# Altium project 4G_V1.3.PrjPcb
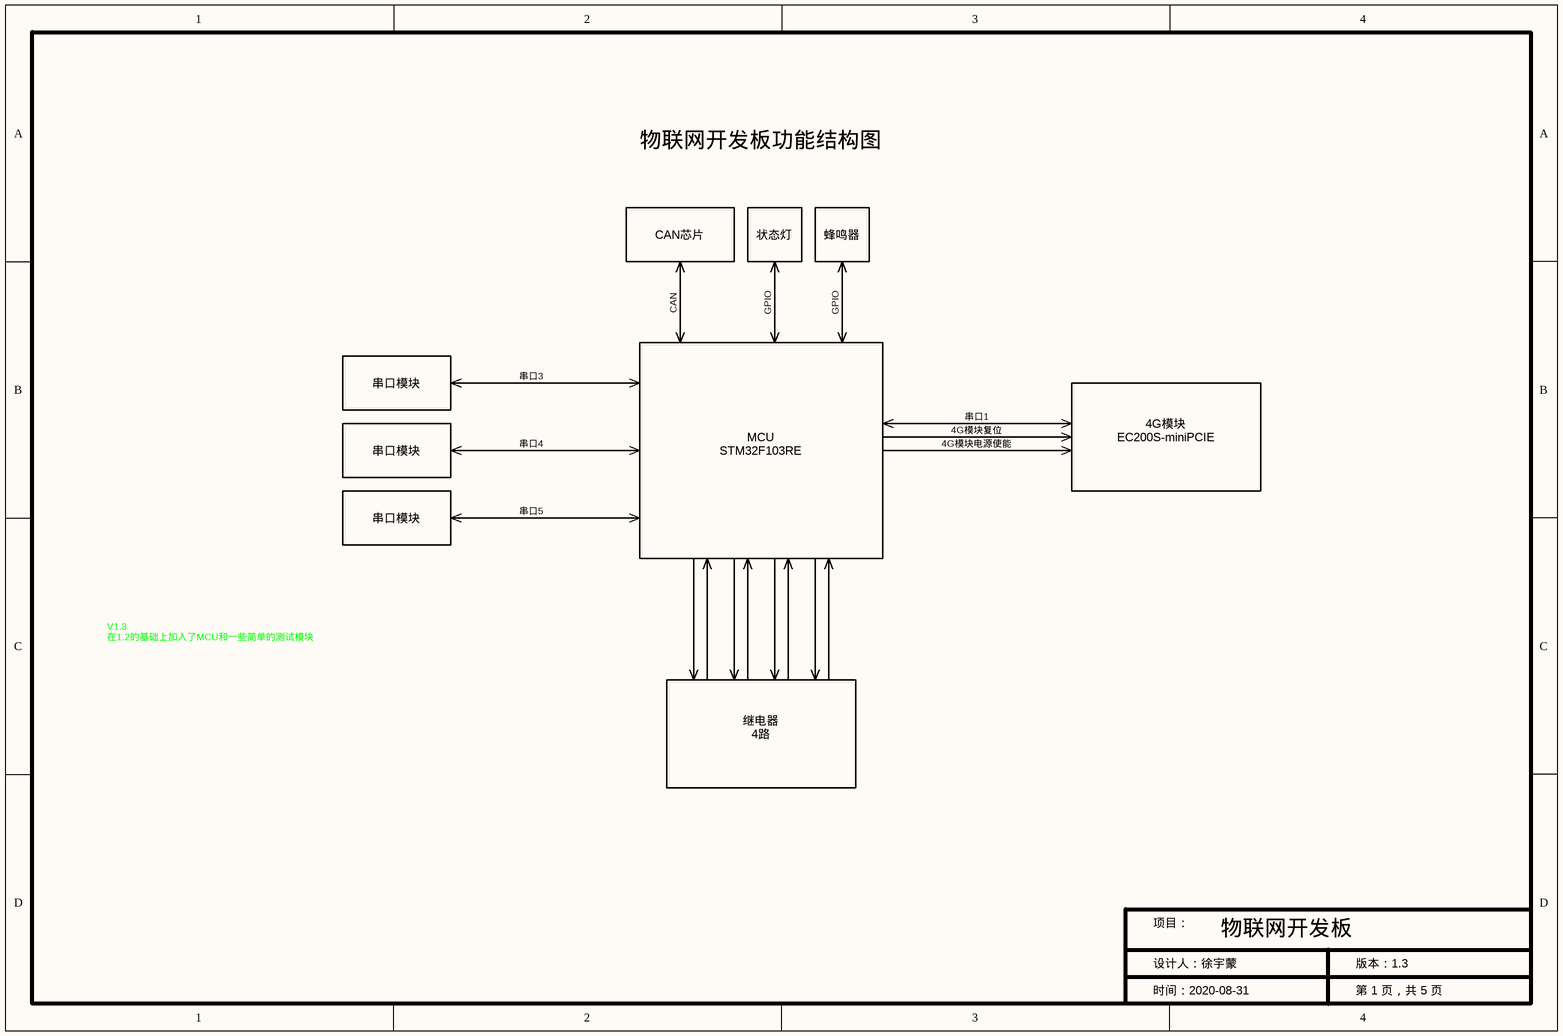
[diagram p0: 01_模块结构图.SchDoc]
5 sheets, 88 parts. Net scope: global (net labels, ports and power ports of the same name join across sheets).
Board file: 物联网开发板.PcbDoc
Sheets:
  01_模块结构图.SchDoc
  02_电源部分.SchDoc
  03_MCU部分.SchDoc
  04_4G模块和外围电路.SchDoc
  05_信号驱动部分.SchDoc

## Sheet 01_模块结构图.SchDoc
size A4; DocumentNumber: 1; SheetNumber: 1; SheetTotal: 4

### Notes on the sheet
- 物联网开发板功能结构图
- CAN芯片
- 状态灯
- 蜂鸣器
- CAN
- GPIO
- 串口模块
- 串口3
- 串口4
- MCU
- STM32F103RE
- 串口1
- 4G模块复位
- 4G模块电源使能
- 4G模块
- EC200S-miniPCIE
- 串口5
- V1.3
  在1.2的基础上加入了MCU和一些简单的测试模块
- 继电器
- 4路
- 项目：
- 物联网开发板
- 时间：2020-08-31
- 设计人：徐宇蒙
- 第 1 页，共 5 页
- 版本：1.3

## Sheet 02_电源部分.SchDoc
size A4; DocumentNumber: 2; SheetNumber: 2; SheetTotal: 4
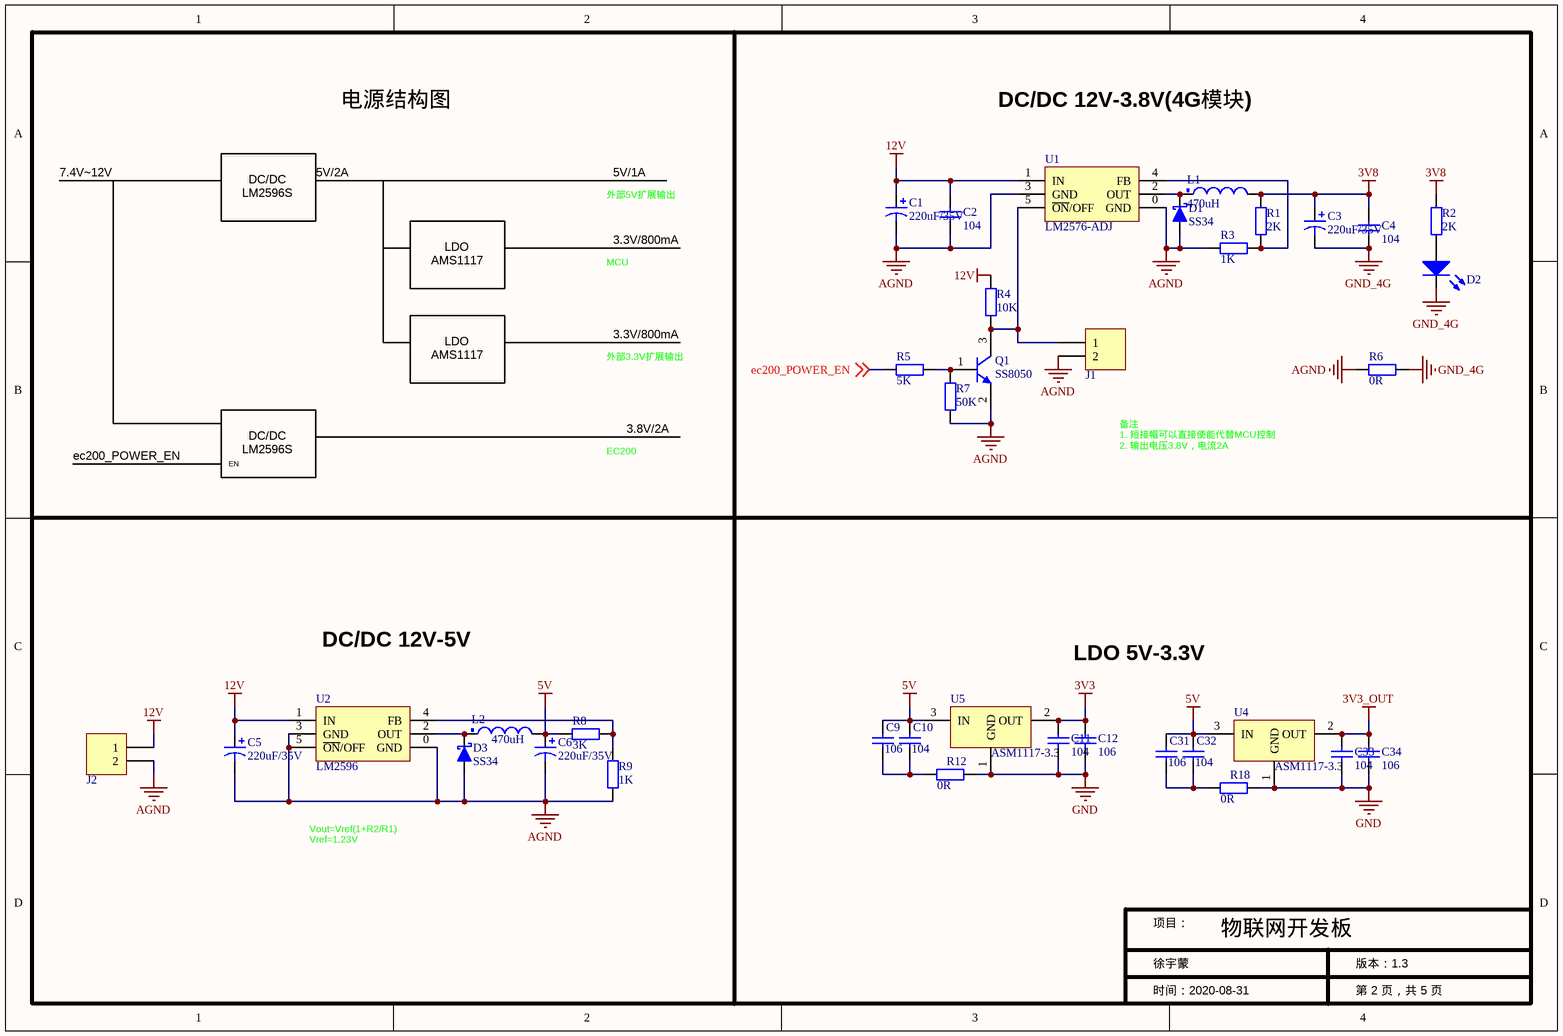
[diagram p1: 02_电源部分.SchDoc]

### Parts
C1  value 220uF/35V  [Cap8x10.5mm]  (hidden comment: Cap Pol)
C2  value 104  [CAP-0603]  (hidden comment: Cap)
C3  value 220uF/35V  [Cap8x10.5mm]  (hidden comment: Cap Pol)
C4  value 104  [CAP-0603]  (hidden comment: Cap)
C5  value 220uF/35V  [Cap8x10.5mm]  (hidden comment: Cap Pol)
C6  value 220uF/35V  [Cap8x10.5mm]  (hidden comment: Cap Pol)
C9  value 106  [CAP-0603]  (hidden comment: Cap)
C10  value 104  [CAP-0603]  (hidden comment: Cap)
C11  value 104  [CAP-0603]  (hidden comment: Cap)
C12  value 106  [CAP-0603]  (hidden comment: Cap)
C31  value 106  [CAP-0603]  (hidden comment: Cap)
C32  value 104  [CAP-0603]  (hidden comment: Cap)
C33  value 104  [CAP-0603]  (hidden comment: Cap)
C34  value 106  [CAP-0603]  (hidden comment: Cap)
D1  SS34  [SMA(DO-214AC)]
D2  LED  [LED_0805]  (value not drawn)
D3  SS34  [SMA(DO-214AC)]
J1  Header 2  [Header_2X1_2.54]  (value not drawn)
J2  Header 2  [Header_HT_2P_5.08_Right]  (value not drawn)
L1  value 470uH  [CD43]  (hidden comment: Inductor)
L2  value 470uH  [CD43]  (hidden comment: Inductor)
Q1  SS8050  [SOT-23]
R1  value 2K  [0603]  (hidden comment: Res)
R2  value 2K  [0603]  (hidden comment: Res)
R3  value 1K  [0603]  (hidden comment: Res)
R4  value 10K  [0603]  (hidden comment: Res)
R5  value 5K  [0603]  (hidden comment: Res)
R6  value 0R  [0805]  (hidden comment: Res)
R7  value 50K  [0603]  (hidden comment: Res)
R8  value 3K  [0603]  (hidden comment: Res)
R9  value 1K  [0603]  (hidden comment: Res)
R12  value 0R  [0805]  (hidden comment: Res)
R18  value 0R  [0805]  (hidden comment: Res)
U1  LM2576-ADJ  [TO-263-5 无背面散热]
U2  LM2596  [TO-263-5 无背面散热]
U4  ASM1117-3.3  [SOT-223]
U5  ASM1117-3.3  [SOT-223]

### Nets
3V3: C11.2 C12.2 U5.2(OUT)
3V3_OUT: C33.2 C34.2 U4.2(OUT)
3V8: C3.1 C4.2 L1.2 R1.1 R2.2
5V: C6.1 C9.2 C10.2 C31.2 C32.2 L2.2 R8.1 U4.3(IN) U5.3(IN)
12V: C1.1 C2.2 C5.1 J2.1 R4.1 U1.1(IN) U2.1(IN)
AGND: C1.2 C2.1 C5.2 C6.2 D1.1(A) D3.1(A) J1.2 J2.2 Q1.2(E) R3.1 R6.1 R7.2 R9.1 U1.0(GND) U1.3(GND) U2.0(GND) U2.3(GND) U2.5(~{ON}/OFF)
GND: C11.1 C12.1 C33.1 C34.1 R12.2 R18.2 U4.1(GND) U5.1(GND)
GND_4G: C3.2 C4.1 D2.2(K) R6.2
ec200_POWER_EN: R5.1 ; off-sheet ec200_POWER_EN  [project net PA1]
NetC9_1: C9.1 C10.1 R12.1
NetC31_1: C31.1 C32.1 R18.1
NetD1_2: D1.2(K) L1.1 U1.2(OUT)
NetD2_1: D2.1(A) R2.1
NetD3_2: D3.2(K) L2.1 U2.2(OUT)
NetJ1_1: J1.1 Q1.3(C) R4.2 U1.5(~{ON}/OFF)
NetQ1_1: Q1.1(B) R5.2 R7.1
NetR1_2: R1.2 R3.2 U1.4(FB)
NetR8_2: R8.2 R9.2 U2.4(FB)

### Notes on the sheet
- 电源结构图
- DC/DC 12V-3.8V(4G模块)
- 7.4V~12V
- 5V/2A
- 5V/1A
- LM2596S
- DC/DC
- LDO
- 外部5V扩展输出
- 3.3V/800mA
- AMS1117
- MCU
- 外部3.3V扩展输出
- 3.8V/2A
- ec200_POWER_EN
- EN
- EC200
- 备注
  1. 短接帽可以直接使能代替MCU控制
  2. 输出电压3.8V，电流2A
- DC/DC 12V-5V
- LDO 5V-3.3V
- Vout=Vref(1+R2/R1)
  Vref=1.23V
- 项目：
- 物联网开发板
- 徐宇蒙
- 时间：2020-08-31
- 第 2 页，共 5 页
- 版本：1.3

### Library data of the parts
C1 C3 C5 C6 = Cap Pol: 贴片电解电容 8*10.5mm; Published: 8-Jun-2000; LatestRevisionDate: 17-Jul-2002; LatestRevisionNote: Re-released for DXP Platform.; PackageReference: POLAR0.8; Publisher: Altium Limited
C2 C4 C9-C12 C31-C34 = Cap: 无极性电容; Published: 8-Jun-2000; LatestRevisionDate: 17-Jul-2002; LatestRevisionNote: Re-released for DXP Platform.; PackageReference: RAD-0.3; Publisher: Altium Limited
D1 D3 = D Schottky: Schottky Diode; Published: 8-Jun-2000; LatestRevisionDate: 17-Jul-2002; LatestRevisionNote: Re-released for DXP Platform.; PackageReference: SMB; Publisher: Altium Limited; Code_JEDEC: DO-214-AA
D2 = LED: 发光二极管; Published: 8-Jun-2000; LatestRevisionDate: 08-Jul-2005; LatestRevisionNote: Mech Layer 1 removed.; PackageReference: LED-0; Publisher: Altium Limited
J1 J2 = Header 2: 接插件; LatestRevisionDate: 17-Jul-2002; LatestRevisionNote: Re-released for DXP Platform.; Publisher: Altium Limited
L1 L2 = Inductor: 贴片功率电感; Code_IEC: 1005; Published: 8-Jun-2000; LatestRevisionDate: 17-Jul-2002; LatestRevisionNote: Re-released for DXP Platform.; PackageReference: 0402-A; Publisher: Altium Limited; Code_JEITA: 0402
Q1 = SS8050: NPN贴片三极管; Published: 8-Jun-2000; LatestRevisionDate: 15-Jan-2003; LatestRevisionNote: PCB Footprint 'BCY-W3/D4.7' replaced; DatasheetDocument: 1997; PackageDocument: Sep-1998; PackageReference: TO-92A; Publisher: Altium Limited; Code_JEDEC: TO-92A; ComponentLink1Description: Manufacturer Link; ComponentLink1URL: http://www.fairchildsemi.com/; ComponentLink2Description: Datasheet; ComponentLink2URL: http://www.fairchildsemi.com/ds/2N%2F2N3904.pdf
R1-R9 R12 R18 = Res: 贴片电阻; Published: 8-Jun-2000; LatestRevisionDate: 17-Jul-2002; LatestRevisionNote: Re-released for DXP Platform.; PackageReference: AXIAL-0.4; Publisher: Altium Limited
U1 = LM2576
U2 = LM2596: DC/DC
U4 U5 = ASM1117: 3.3V稳压芯片

## Sheet 03_MCU部分.SchDoc
size A4; DocumentNumber: 3; SheetNumber: 3; SheetTotal: 4
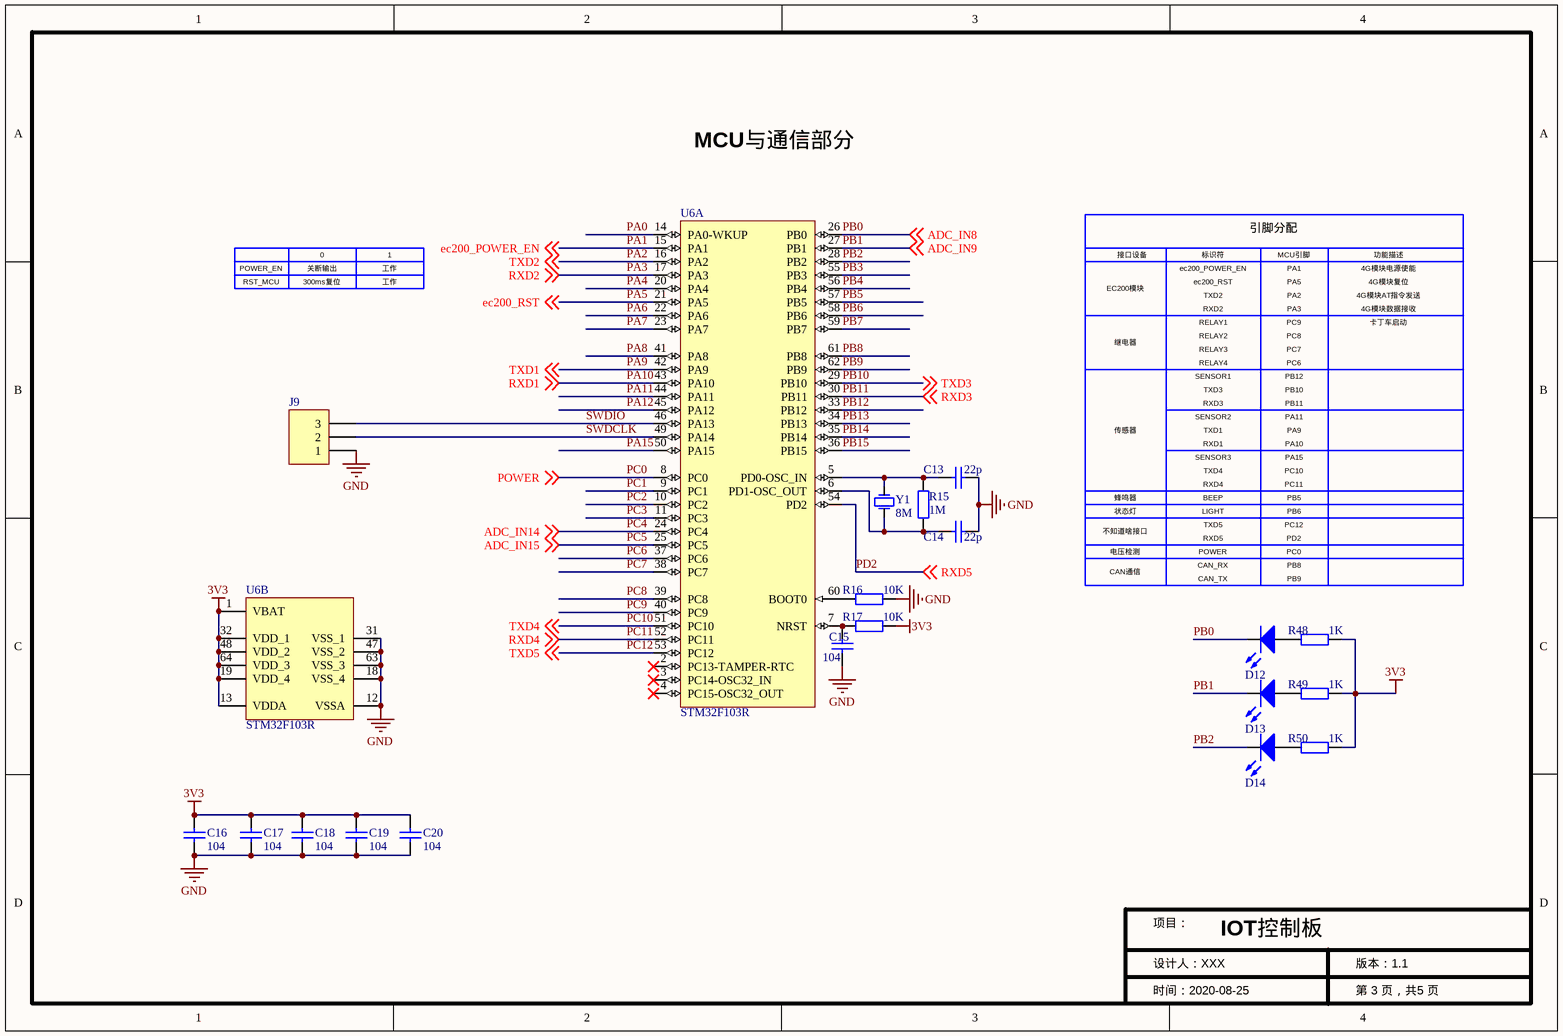
[diagram p2: 03_MCU部分.SchDoc]

### Parts
C13  value 22p  [CAP-0603]  (hidden comment: Cap)
C14  value 22p  [CAP-0603]  (hidden comment: Cap)
C15  value 104  [CAP-0603]  (hidden comment: Cap)
C16  value 104  [CAP-0603]  (hidden comment: Cap)
C17  value 104  [CAP-0603]  (hidden comment: Cap)
C18  value 104  [CAP-0603]  (hidden comment: Cap)
C19  value 104  [CAP-0603]  (hidden comment: Cap)
C20  value 104  [CAP-0603]  (hidden comment: Cap)
D12  LED  [LED_0805]  (value not drawn)
D13  LED  [LED_0805]  (value not drawn)
D14  LED  [LED_0805]  (value not drawn)
J9  Header3  [Header_3X1_2.54_排针]  (value not drawn)
R15  value 1M  [0603]  (hidden comment: Res)
R16  value 10K  [0603]  (hidden comment: Res)
R17  value 10K  [0603]  (hidden comment: Res)
R48  value 1K  [0603]  (hidden comment: Res)
R49  value 1K  [0603]  (hidden comment: Res)
R50  value 1K  [0603]  (hidden comment: Res)
U6  STM32F103R  [LQFP64]  (parts A,B of 2)
Y1  value 8M  [X-SM49]  (hidden comment: XTAL)

### Nets
3V3: C16.2 C17.2 C18.2 C19.2 C20.2 R17.1 R48.1 R49.1 R50.1 U6.1(VBAT) U6.13(VDDA) U6.19(VDD_4) U6.32(VDD_1) U6.48(VDD_2) U6.64(VDD_3)
GND: C13.1 C14.1 C15.1 C16.1 C17.1 C18.1 C19.1 C20.1 J9.1 R16.1 U6.12(VSSA) U6.18(VSS_4) U6.31(VSS_1) U6.47(VSS_2) U6.63(VSS_3)
PA0: U6.14(PA0-WKUP)
PA1: U6.15(PA1) ; off-sheet ec200_POWER_EN  [also labelled ec200_POWER_EN]
PA2: U6.16(PA2) ; off-sheet TXD2  [also labelled TXD2]
PA3: U6.17(PA3) ; off-sheet RXD2  [also labelled RXD2]
PA4: U6.20(PA4)
PA5: U6.21(PA5) ; off-sheet ec200_RST  [also labelled ec200_RST]
PA6: U6.22(PA6)
PA7: U6.23(PA7)
PA8: U6.41(PA8)
PA9: U6.42(PA9) ; off-sheet TXD1  [also labelled TXD1]
PA10: U6.43(PA10) ; off-sheet RXD1  [also labelled RXD1]
PA11: U6.44(PA11)
PA12: U6.45(PA12)
PA15: U6.50(PA15)
PB0: D12.2(K) U6.26(PB0) ; off-sheet ADC_IN8  [also labelled ADC_IN8]
PB1: D13.2(K) U6.27(PB1) ; off-sheet ADC_IN9  [also labelled ADC_IN9]
PB2: D14.2(K) U6.28(PB2)
PB3: U6.55(PB3)
PB4: U6.56(PB4)
PB5: U6.57(PB5)
PB6: U6.58(PB6)
PB7: U6.59(PB7)
PB8: U6.61(PB8)
PB9: U6.62(PB9)
PB10: U6.29(PB10) ; off-sheet TXD3  [also labelled TXD3]
PB11: U6.30(PB11) ; off-sheet RXD3  [also labelled RXD3]
PB12: U6.33(PB12)
PB13: U6.34(PB13)
PB14: U6.35(PB14)
PB15: U6.36(PB15)
PC0: U6.8(PC0) ; off-sheet POWER  [also labelled POWER]
PC1: U6.9(PC1)
PC2: U6.10(PC2)
PC3: U6.11(PC3)
PC4: U6.24(PC4) ; off-sheet ADC_IN14  [also labelled ADC_IN14]
PC5: U6.25(PC5) ; off-sheet ADC_IN15  [also labelled ADC_IN15]
PC6: U6.37(PC6)
PC7: U6.38(PC7)
PC8: U6.39(PC8)
PC9: U6.40(PC9)
PC10: U6.51(PC10) ; off-sheet TXD4  [also labelled TXD4]
PC11: U6.52(PC11) ; off-sheet RXD4  [also labelled RXD4]
PC12: U6.53(PC12) ; off-sheet TXD5  [also labelled TXD5]
PD2: U6.54(PD2) ; off-sheet RXD5  [also labelled RXD5]
SWDCLK: J9.2 U6.49(PA14)
SWDIO: J9.3 U6.46(PA13)
NetC13_2: C13.2 R15.2 U6.5(PD0-OSC_IN) Y1.2
NetC14_2: C14.2 R15.1 U6.6(PD1-OSC_OUT) Y1.1
NetC15_2: C15.2 R17.2 U6.7(NRST)
NetD12_1: D12.1(A) R48.2
NetD13_1: D13.1(A) R49.2
NetD14_1: D14.1(A) R50.2
NetR16_2: R16.2 U6.60(BOOT0)

Not connected (* = marked no-connect by the designer): U6 2(PC13-TAMPER-RTC)* 3(PC14-OSC32_IN)* 4(PC15-OSC32_OUT)*

### Notes on the sheet
- MCU与通信部分
- 0
- 1
- 接口设备
- 标识符
- 引脚分配
- MCU引脚
- 功能描述
- POWER_EN
- RST_MCU
- 关断输出
- 300ms复位
- 工作
- EC200模块
- ec200_POWER_EN
- ec200_RST
- TXD2
- RXD2
- PA1
- PA5
- PA2
- PA3
- 4G模块电源使能
- 4G模块复位
- 4G模块AT指令发送
- 4G模块数据接收
- 继电器
- RELAY1
- RELAY2
- RELAY3
- RELAY4
- SENSOR1
- TXD3
- PB10
- PB12
- PC6
- PC7
- PC8
- PC9
- 卡丁车启动
- 传感器
- RXD3
- SENSOR2
- TXD1
- RXD1
- PB11
- PA9
- PA10
- PA11
- 蜂鸣器
- 状态灯
- SENSOR3
- BEEP
- LIGHT
- TXD5
- TXD4
- RXD4
- PC12
- PC10
- PC11
- PA15
- PB6
- PB5
- 不知道啥接口
- 电压检测
- CAN通信
- RXD5
- POWER
- CAN_RX
- CAN_TX
- PD2
- PC0
- PB8
- PB9
- 项目：
- IOT控制板
- 设计人：XXX
- 时间：2020-08-25
- 第 3 页，共5 页
- 版本：1.1

### Library data of the parts
C13-C20 = Cap: 无极性电容; Published: 8-Jun-2000; LatestRevisionDate: 17-Jul-2002; LatestRevisionNote: Re-released for DXP Platform.; PackageReference: RAD-0.3; Publisher: Altium Limited
D12-D14 = LED: 发光二极管; Published: 8-Jun-2000; LatestRevisionDate: 08-Jul-2005; LatestRevisionNote: Mech Layer 1 removed.; PackageReference: LED-0; Publisher: Altium Limited
J9 = Header3: 接插件
R15-R17 R48-R50 = Res: 贴片电阻; Published: 8-Jun-2000; LatestRevisionDate: 17-Jul-2002; LatestRevisionNote: Re-released for DXP Platform.; PackageReference: AXIAL-0.4; Publisher: Altium Limited
U6 = STM32F103R: STM32单片机64引脚; PartNumber: STM32F103RGT6; A/D Converter: 3x12-bit (16 Channel); Core: ARM Cortex-M3; D/A Converter: 2x12-bit (2 Channel); FLASH Size (Prog) (kB): 1024; I/Os (High Current): 51; Internal RAM Size (kB): 96; Operating Frequency(F) (Processor speed) (MHz): 72; Packing: Tray; Supply Voltage(Vcc) min (V): 2; DatasheetVersion: Rev. 3; PackageVersion: Rev. 4, 06/2013; PackageReference: LQFP64; PackageDescription: 64-Pin Low Profile Quad Flat Package, 10 x 10 mm Body, 0.5 mm Pitch; Supplier 1: Digi-Key; Supplier Part Number 1: 497-11118-ND; Supplier 2: Farnell; Supplier Part Number 2: 2215220; Supplier 3: Newark; Supplier Part Number 3: 21T4016; Supplier 4: Mouser; Supplier Part Number 4: 511-STM32F103RGT6; Mounting Technology: Surface Mount; ComponentLink1Description: Manufacturer URL; ComponentLink1URL: http://www.st.com/web/en/home.html; ComponentLink2Description: Datasheet; ComponentLink2URL: http://www.st.com/st-web-ui/static/active/en/resource/technical/document/datasheet/CD00253742.pdf; ComponentLink3Description: Package Specification; ComponentLink3URL: http://www.st.com/st-web-ui/static/active/en/resource/technical/document/datasheet/DM00037051.pdf
Y1 = XTAL: 晶振; Published: 8-Jun-2000; LatestRevisionDate: 17-Jul-2002; LatestRevisionNote: Re-released for DXP Platform.; PackageReference: R38; Publisher: Altium Limited

## Sheet 04_4G模块和外围电路.SchDoc
size A4; DocumentNumber: 4; SheetNumber: 4; SheetTotal: 4
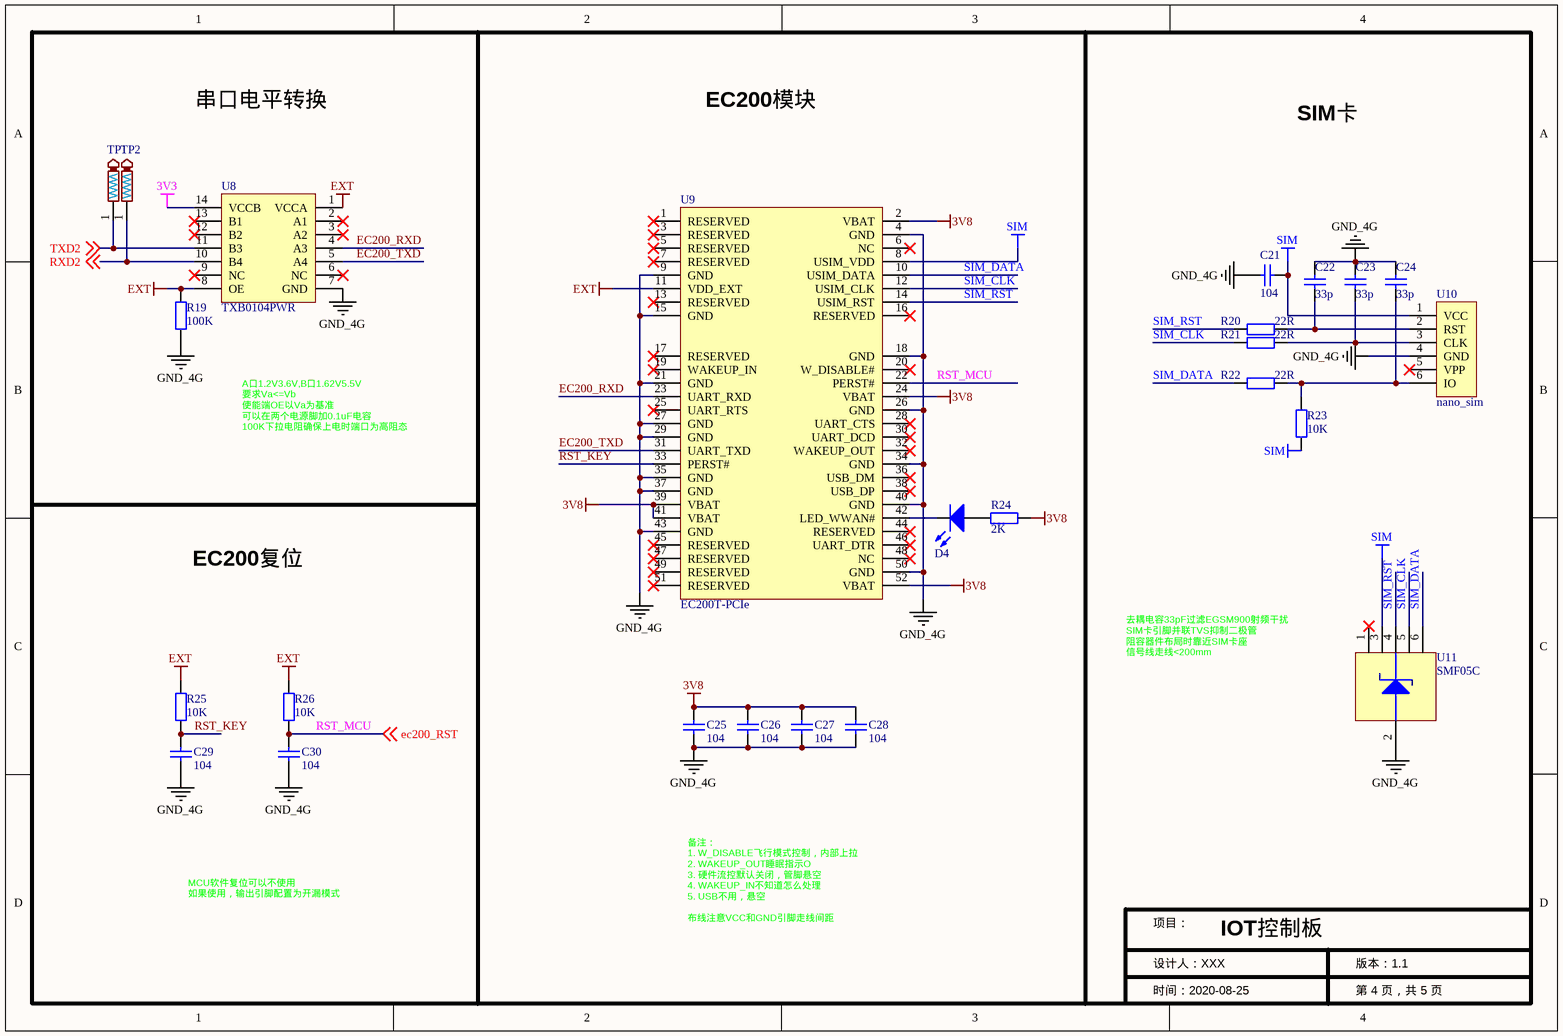
[diagram p3: 04_4G模块和外围电路.SchDoc]

### Parts
C21  value 104  [CAP-0603]  (hidden comment: Cap)
C22  value 33p  [CAP-0603]  (hidden comment: Cap)
C23  value 33p  [CAP-0603]  (hidden comment: Cap)
C24  value 33p  [CAP-0603]  (hidden comment: Cap)
C25  value 104  [CAP-0603]  (hidden comment: Cap)
C26  value 104  [CAP-0603]  (hidden comment: Cap)
C27  value 104  [CAP-0603]  (hidden comment: Cap)
C28  value 104  [CAP-0603]  (hidden comment: Cap)
C29  value 104  [CAP-0603]  (hidden comment: Cap)
C30  value 104  [CAP-0603]  (hidden comment: Cap)
D4  LED  [LED_0805]  (value not drawn)
R19  value 100K  [0603]  (hidden comment: Res)
R20  value 22R  [0603]  (hidden comment: Res)
R21  value 22R  [0603]  (hidden comment: Res)
R22  value 22R  [0603]  (hidden comment: Res)
R23  value 10K  [0603]  (hidden comment: Res)
R24  value 2K  [0603]  (hidden comment: Res)
R25  value 10K  [0603]  (hidden comment: Res)
R26  value 10K  [0603]  (hidden comment: Res)
TP1  TestPoint  [TESTPOINT]  (value not drawn)
TP2  TestPoint  [TESTPOINT]  (value not drawn)
U8  TXB0104PWR  [TSSOP-14]
U9  EC200T-PCIe  [miniPCIe1]
U10  nano_sim  [Nano_SIM_6P]
U11  SMF05C  [SOT-363]

### Nets
3V3: U8.14(VCCB)
3V8: C25.2 C26.2 C27.2 C28.2 R24.1 U9.2(VBAT) U9.24(VBAT) U9.39(VBAT) U9.41(VBAT) U9.52(VBAT)
EXT: R19.2 R25.2 R26.1 U8.1(VCCA) U8.8(OE) U9.11(VDD_EXT)
GND_4G: C21.2 C22.1 C23.1 C24.2 C25.1 C26.1 C27.1 C28.1 C29.1 C30.2 R19.1 U8.7(GND) U9.4(GND) U9.9(GND) U9.15(GND) U9.18(GND) U9.21(GND) U9.26(GND) U9.27(GND) U9.29(GND) U9.34(GND) U9.35(GND) U9.37(GND) U9.40(GND) U9.43(GND) U9.50(GND) U10.4(GND) U11.2(gnd)
SIM: C21.1 R23.2 U9.8(USIM_VDD) U10.1(VCC) U11.3(gnd)
ec200_RST: C30.1 R26.2 U9.22(PERST#) ; off-sheet ec200_RST  [also labelled RST_MCU]  [project net PA5]
EC200_RXD: U8.4(A3) U9.23(UART_RXD)
EC200_TXD: U8.5(A4) U9.31(UART_TXD)
RST_KEY: C29.2 R25.1 U9.33(PERST#)
RXD2: TP2.1(OSC_OUT) U8.10(B4) ; off-sheet RXD2  [project net PA3]
SIM_CLK: R21.1 U9.12(USIM_CLK) U11.5(gnd)
SIM_DATA: R22.1 U9.10(USIM_DATA) U11.6(gnd)
SIM_RST: R20.1 U9.14(USIM_RST) U11.4(gnd)
TXD2: TP1.1(OSC_OUT) U8.11(B3) ; off-sheet TXD2  [project net PA2]
NetC22_2: C22.2 R20.2 U10.2(RST)
NetC23_2: C23.2 R21.2 U10.3(CLK)
NetC24_1: C24.1 R22.2 R23.1 U10.6(IO)
NetD4_1: D4.1(A) R24.2
NetD4_2: D4.2(K) U9.42(LED_WWAN#)

Not connected (* = marked no-connect by the designer): U8 2(A1)* 3(A2)* 6(NC)* 9(NC)* 12(B2)* 13(B1)*; U9 1(RESERVED)* 3(RESERVED)* 5(RESERVED)* 6(NC)* 7(RESERVED)* 13(RESERVED)* 16(RESERVED)* 17(RESERVED)* 19(WAKEUP_IN)* 20(W_DISABLE#)* 25(UART_RTS)* 28(UART_CTS)* 30(UART_DCD)* 32(WAKEUP_OUT)* 36(USB_DM)* 38(USB_DP)* 44(RESERVED)* 45(RESERVED)* 46(UART_DTR)* 47(RESERVED)* 48(NC)* 49(RESERVED)* 51(RESERVED)*; U10 5(VPP)*; U11 1(gnd)*

### Notes on the sheet
- 串口电平转换
- EC200模块
- SIM卡
- A口1.2V3.6V,B口1.62V5.5V
  要求Va<=Vb
  使能端OE以Va为基准
  可以在两个电源脚加0.1uF电容
  100K下拉电阻确保上电时端口为高阻态
- EC200复位
- (near U11) 去耦电容33pF过滤EGSM900射频干扰
  SIM卡引脚并联TVS抑制二极管
  阻容器件布局时靠近SIM卡座
  信号线走线<200mm
- MCU软件复位可以不使用
  如果使用，输出引脚配置为开漏模式
- 项目：
- IOT控制板
- 备注：
  1. W_DISABLE飞行模式控制，内部上拉
  2. WAKEUP_OUT睡眠指示O
  3. 硬件流控默认关闭，管脚悬空
  4. WAKEUP_IN不知道怎么处理
  5. USB不用，悬空
  布线注意VCC和GND引脚走线间距
- 设计人：XXX
- 时间：2020-08-25
- 第 4 页，共 5 页
- 版本：1.1

### Library data of the parts
C21-C30 = Cap: 无极性电容; Published: 8-Jun-2000; LatestRevisionDate: 17-Jul-2002; LatestRevisionNote: Re-released for DXP Platform.; PackageReference: RAD-0.3; Publisher: Altium Limited
D4 = LED: 发光二极管; Published: 8-Jun-2000; LatestRevisionDate: 08-Jul-2005; LatestRevisionNote: Mech Layer 1 removed.; PackageReference: LED-0; Publisher: Altium Limited
R19-R26 = Res: 贴片电阻; Published: 8-Jun-2000; LatestRevisionDate: 17-Jul-2002; LatestRevisionNote: Re-released for DXP Platform.; PackageReference: AXIAL-0.4; Publisher: Altium Limited
TP1 TP2 = TestPoint: 测试点
U8 = TXB0104PWR: 电平转换芯片

## Sheet 05_信号驱动部分.SchDoc
size A4
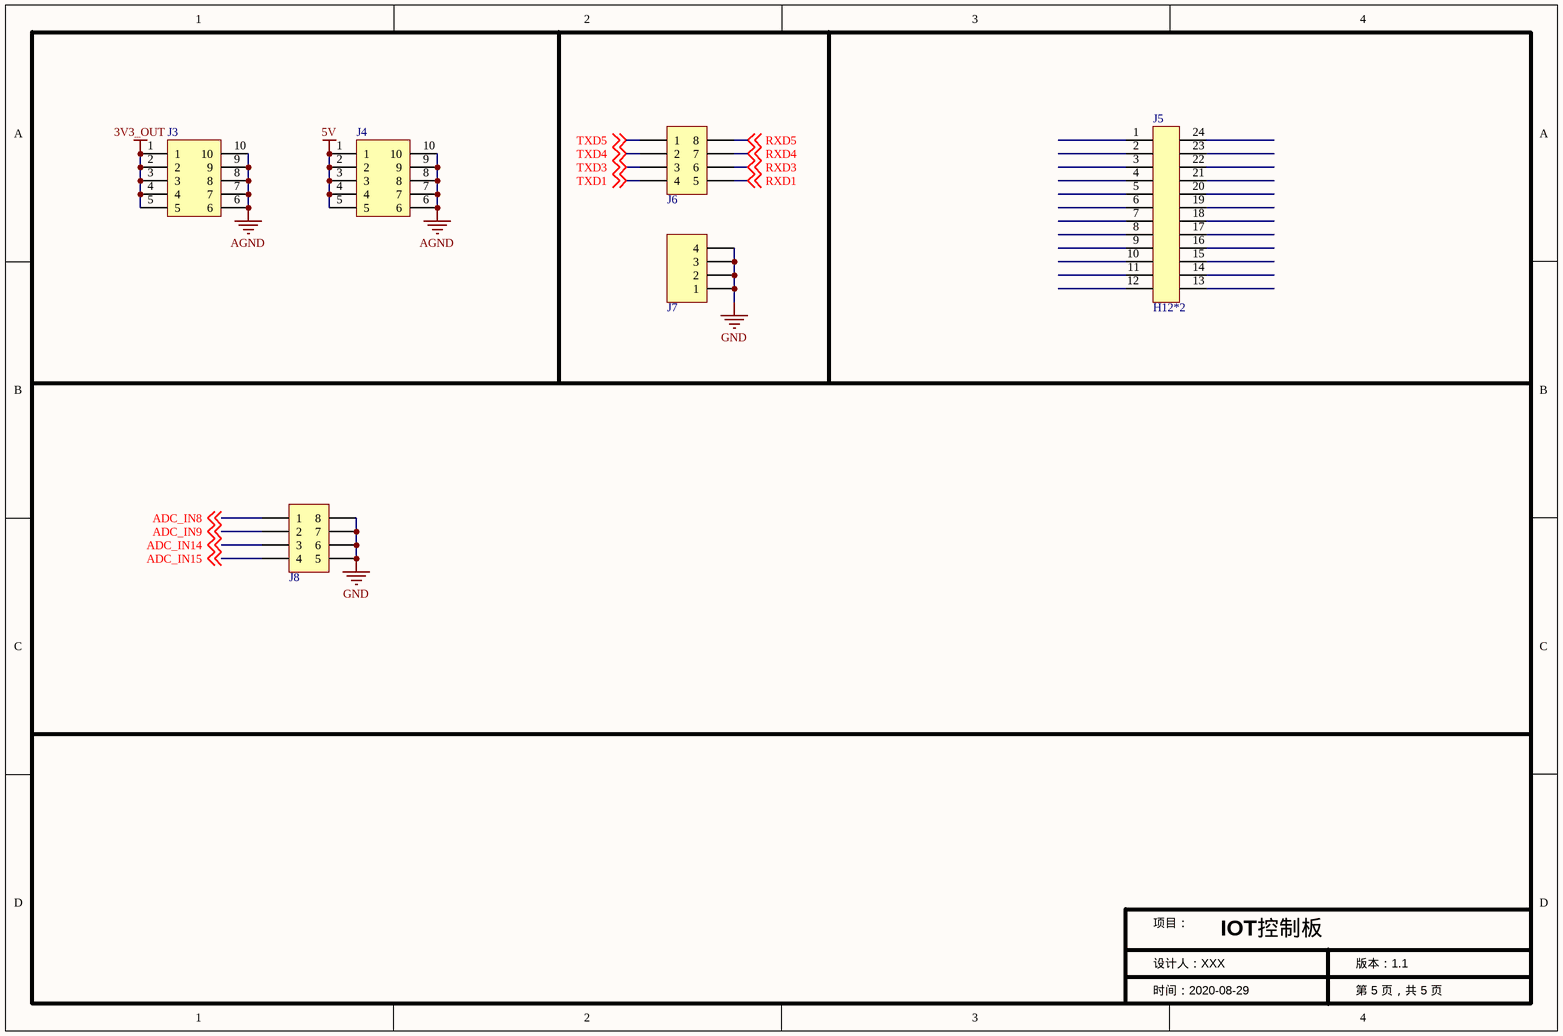
[diagram p4: 05_信号驱动部分.SchDoc]

### Parts
J3  Header_5X2  [Header_5X2_2.54_排针]  (value not drawn)
J4  Header_5X2  [Header_5X2_2.54_排针]  (value not drawn)
J5  H12*2  [H12*2]
J6  Header_4X2  [Header_4x2-2.54]  (value not drawn)
J7  Header 4  [Header_4X1_2.54_排针]  (value not drawn)
J8  Header_4X2  [Header_4x2-2.54]  (value not drawn)

### Nets
3V3_OUT: J3.1 J3.2 J3.3 J3.4 J3.5
5V: J4.1 J4.2 J4.3 J4.4 J4.5
AGND: J3.6 J3.7 J3.8 J3.9 J3.10 J4.6 J4.7 J4.8 J4.9 J4.10
GND: J7.1 J7.2 J7.3 J7.4 J8.5 J8.6 J8.7 J8.8
ADC_IN8: J8.1 ; off-sheet ADC_IN8  [project net PB0]
ADC_IN9: J8.2 ; off-sheet ADC_IN9  [project net PB1]
ADC_IN14: J8.3 ; off-sheet ADC_IN14  [project net PC4]
ADC_IN15: J8.4 ; off-sheet ADC_IN15  [project net PC5]
RXD1: J6.5 ; off-sheet RXD1  [project net PA10]
RXD3: J6.6 ; off-sheet RXD3  [project net PB11]
RXD4: J6.7 ; off-sheet RXD4  [project net PC11]
RXD5: J6.8 ; off-sheet RXD5  [project net PD2]
TXD1: J6.4 ; off-sheet TXD1  [project net PA9]
TXD3: J6.3 ; off-sheet TXD3  [project net PB10]
TXD4: J6.2 ; off-sheet TXD4  [project net PC10]
TXD5: J6.1 ; off-sheet TXD5  [project net PC12]

Not connected (* = marked no-connect by the designer): J5 1 2 3 4 5 6 7 8 9 10 11 12 13 14 15 16 17 18 19 20 21 22 23 24

### Notes on the sheet
- 项目：
- IOT控制板
- 设计人：XXX
- 时间：2020-08-29
- 第 5 页，共 5 页
- 版本：1.1

### Library data of the parts
J3 J4 = Header_5X2: 接插件
J6 J8 = Header_4X2: 接插件; LatestRevisionDate: 17-Jul-2002; LatestRevisionNote: Re-released for DXP Platform.; Publisher: Altium Limited
J7 = Header 4: 接插件; LatestRevisionDate: 17-Jul-2002; LatestRevisionNote: Re-released for DXP Platform.; Publisher: Altium Limited

## Nets that join several sheets
3V3: 02_电源部分 (C11.2 C12.2 U5.2), 03_MCU部分 (15 pins), 04_4G模块和外围电路 (U8.14)
3V3_OUT: 02_电源部分 (C33.2 C34.2 U4.2), 05_信号驱动部分 (5 pins)
3V8: 02_电源部分 (5 pins), 04_4G模块和外围电路 (10 pins)
5V: 02_电源部分 (9 pins), 05_信号驱动部分 (5 pins)
AGND: 02_电源部分 (18 pins), 05_信号驱动部分 (10 pins)
GND: 02_电源部分 (8 pins), 03_MCU部分 (15 pins), 05_信号驱动部分 (8 pins)
GND_4G: 02_电源部分 (C3.2 C4.1 D2.2 R6.2), 04_4G模块和外围电路 (28 pins)
PA1: 02_电源部分 (R5.1), 03_MCU部分 (U6.15)
PA2: 03_MCU部分 (U6.16), 04_4G模块和外围电路 (TP1.1 U8.11)
PA3: 03_MCU部分 (U6.17), 04_4G模块和外围电路 (TP2.1 U8.10)
PA5: 03_MCU部分 (U6.21), 04_4G模块和外围电路 (C30.1 R26.2 U9.22)
PA9: 03_MCU部分 (U6.42), 05_信号驱动部分 (J6.4)
PA10: 03_MCU部分 (U6.43), 05_信号驱动部分 (J6.5)
PB0: 03_MCU部分 (D12.2 U6.26), 05_信号驱动部分 (J8.1)
PB1: 03_MCU部分 (D13.2 U6.27), 05_信号驱动部分 (J8.2)
PB10: 03_MCU部分 (U6.29), 05_信号驱动部分 (J6.3)
PB11: 03_MCU部分 (U6.30), 05_信号驱动部分 (J6.6)
PC4: 03_MCU部分 (U6.24), 05_信号驱动部分 (J8.3)
PC5: 03_MCU部分 (U6.25), 05_信号驱动部分 (J8.4)
PC10: 03_MCU部分 (U6.51), 05_信号驱动部分 (J6.2)
PC11: 03_MCU部分 (U6.52), 05_信号驱动部分 (J6.7)
PC12: 03_MCU部分 (U6.53), 05_信号驱动部分 (J6.1)
PD2: 03_MCU部分 (U6.54), 05_信号驱动部分 (J6.8)